# EAGLE schematic Active noise cancellation (EAGLE 9.6.2)
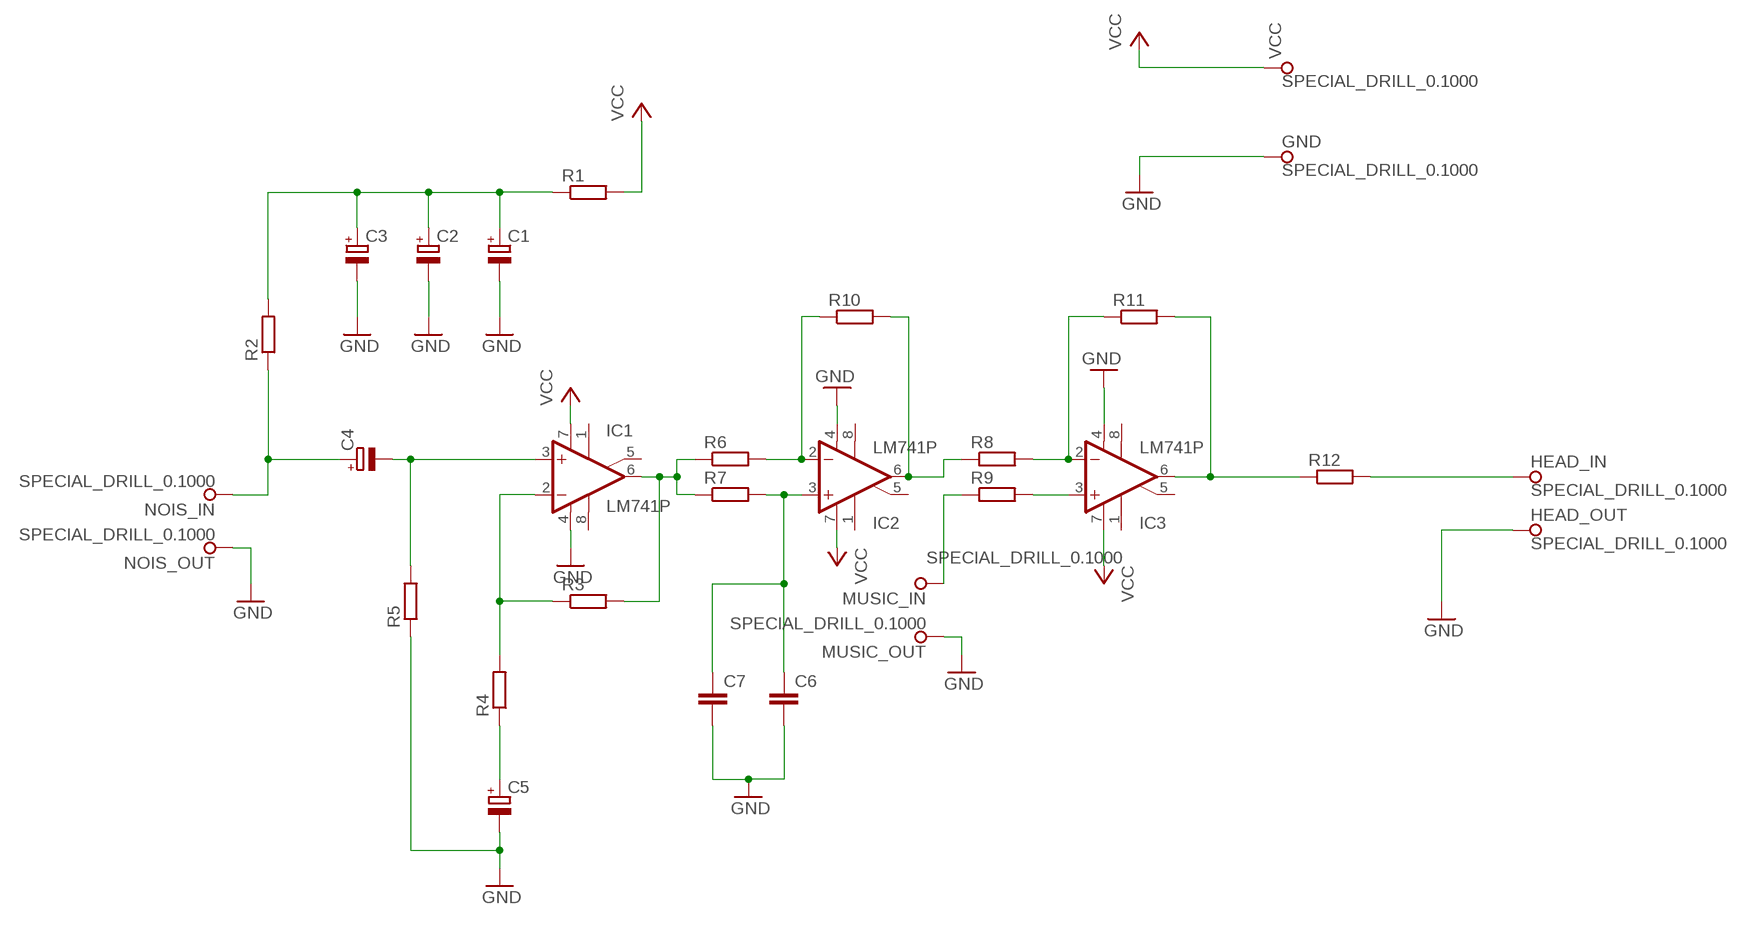
[diagram p0: schematic, sheet 1]

## Parts
C1  CPOL-EUE1.8-4  [E1,8-4]
C2  CPOL-EUE1.8-4  [E1,8-4]
C3  CPOL-EUE1.8-4  [E1,8-4]
C4  CPOL-EUE1.8-4  [E1,8-4]
C5  CPOL-EUE1.8-4  [E1,8-4]
C6  C-EU050-024X044  [C050-024X044]
C7  C-EU050-024X044  [C050-024X044]
GND  SPECIAL_DRILL_0.1000  [PAD_0.1000]
HEAD_IN  SPECIAL_DRILL_0.1000  [PAD_0.1000]
HEAD_OUT  SPECIAL_DRILL_0.1000  [PAD_0.1000]
IC1  LM741P  [DIL08]
IC2  LM741P  [DIL08]
IC3  LM741P  [DIL08]
MUSIC_IN  SPECIAL_DRILL_0.1000  [PAD_0.1000]
MUSIC_OUT  SPECIAL_DRILL_0.1000  [PAD_0.1000]
NOIS_IN  SPECIAL_DRILL_0.1000  [PAD_0.1000]
NOIS_OUT  SPECIAL_DRILL_0.1000  [PAD_0.1000]
R1  R-EU_0204/7  [0204/7]
R2  R-EU_0204/7  [0204/7]
R3  R-EU_0204/7  [0204/7]
R4  R-EU_0204/7  [0204/7]
R5  R-EU_0204/7  [0204/7]
R6  R-EU_0204/7  [0204/7]
R7  R-EU_0204/7  [0204/7]
R8  R-EU_0204/7  [0204/7]
R9  R-EU_0204/7  [0204/7]
R10  R-EU_0204/7  [0204/7]
R11  R-EU_0204/7  [0204/7]
R12  R-EU_0204/7  [0204/7]
VCC  SPECIAL_DRILL_0.1000  [PAD_0.1000]

## Nets
GND: C1.- C2.- C3.- C5.- C6.2 C7.2 GND.1 HEAD_OUT.1 IC1.4(V-) IC2.4(V-) IC3.4(V-) MUSIC_OUT.1 NOIS_OUT.1 R5.1
N$1: C1.+ C2.+ C3.+ R1.1 R2.2
N$2: IC2.6(OUT) R8.1 R10.2
N$3: C4.+ NOIS_IN.1 R2.1
N$4: C4.- IC1.3(+IN) R5.2
N$5: IC1.2(-IN) R3.1 R4.2
N$6: C5.+ R4.1
N$7: IC1.6(OUT) R3.2 R6.1 R7.1
N$8: IC3.2(-IN) R8.2 R11.1
N$9: IC2.2(-IN) R6.2 R10.1
N$10: C6.1 C7.1 IC2.3(+IN) R7.2
N$11: IC3.6(OUT) R11.2 R12.1
N$12: MUSIC_IN.1 R9.1
N$13: HEAD_IN.1 R12.2
N$14: IC3.3(+IN) R9.2
VCC: IC1.7(V+) IC2.7(V+) IC3.7(V+) R1.2 VCC.1
Unconnected: IC1.1(ON1) IC1.5(ON2) IC1.8(OPT) IC2.1(ON1) IC2.5(ON2) IC2.8(OPT) IC3.1(ON1) IC3.5(ON2) IC3.8(OPT)

## Library data of the parts
C1-C5 = rcl:CPOL-EU: POLARIZED CAPACITOR, European symbol; SPICEPREFIX: C
C6 C7 = rcl:C-EU: CAPACITOR, European symbol; SPICEPREFIX: C
GND HEAD_IN HEAD_OUT MUSIC_IN MUSIC_OUT NOIS_IN NOIS_OUT VCC = special-drill:SPECIAL_DRILL_: Special drills
IC1-IC3 = linear:*741: OP AMP
R1-R12 = rcl:R-EU_: RESISTOR, European symbol; SPICEPREFIX: R